# EAGLE schematic led_cube (EAGLE 9.6.2)
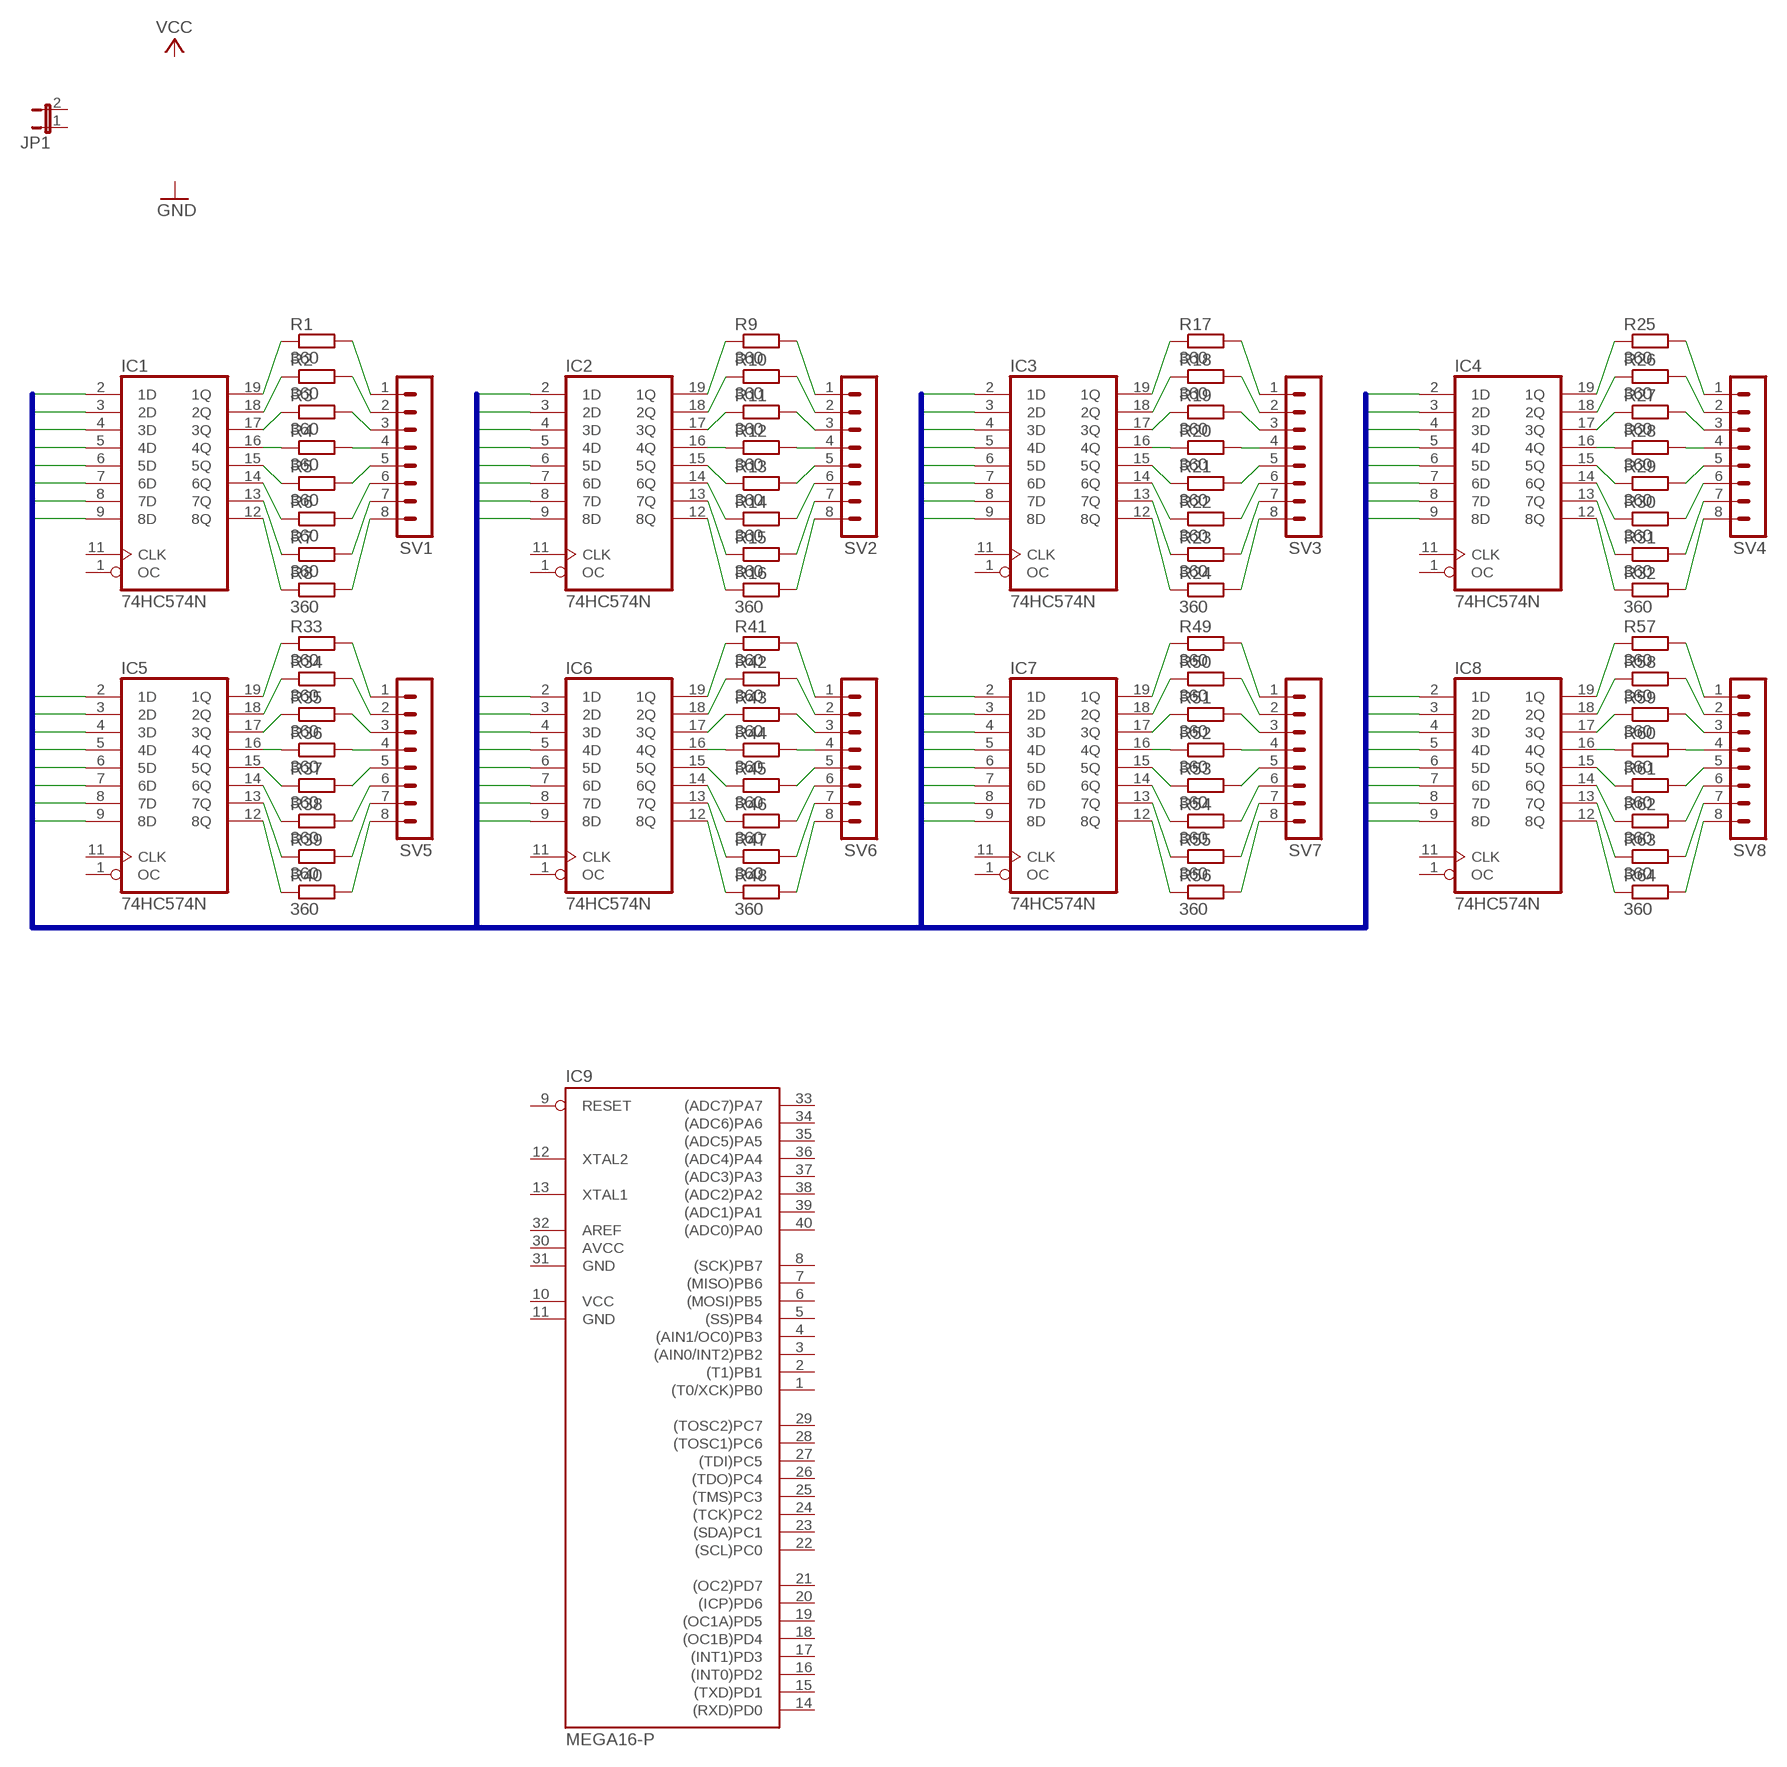
[diagram p0: schematic, sheet 1]

## Parts
IC1  74HC574N  [DIL20]
IC2  74HC574N  [DIL20]
IC3  74HC574N  [DIL20]
IC4  74HC574N  [DIL20]
IC5  74HC574N  [DIL20]
IC6  74HC574N  [DIL20]
IC7  74HC574N  [DIL20]
IC8  74HC574N  [DIL20]
IC9  MEGA16-P  [DIL40]
JP1  JP1E  [JP1]
R1  360  R-EU_0204/5  [0204/5]
R2  360  R-EU_0204/5  [0204/5]
R3  360  R-EU_0204/5  [0204/5]
R4  360  R-EU_0204/5  [0204/5]
R5  360  R-EU_0204/5  [0204/5]
R6  360  R-EU_0204/5  [0204/5]
R7  360  R-EU_0204/5  [0204/5]
R8  360  R-EU_0204/5  [0204/5]
R9  360  R-EU_0204/5  [0204/5]
R10  360  R-EU_0204/5  [0204/5]
R11  360  R-EU_0204/5  [0204/5]
R12  360  R-EU_0204/5  [0204/5]
R13  360  R-EU_0204/5  [0204/5]
R14  360  R-EU_0204/5  [0204/5]
R15  360  R-EU_0204/5  [0204/5]
R16  360  R-EU_0204/5  [0204/5]
R17  360  R-EU_0204/5  [0204/5]
R18  360  R-EU_0204/5  [0204/5]
R19  360  R-EU_0204/5  [0204/5]
R20  360  R-EU_0204/5  [0204/5]
R21  360  R-EU_0204/5  [0204/5]
R22  360  R-EU_0204/5  [0204/5]
R23  360  R-EU_0204/5  [0204/5]
R24  360  R-EU_0204/5  [0204/5]
R25  360  R-EU_0204/5  [0204/5]
R26  360  R-EU_0204/5  [0204/5]
R27  360  R-EU_0204/5  [0204/5]
R28  360  R-EU_0204/5  [0204/5]
R29  360  R-EU_0204/5  [0204/5]
R30  360  R-EU_0204/5  [0204/5]
R31  360  R-EU_0204/5  [0204/5]
R32  360  R-EU_0204/5  [0204/5]
R33  360  R-EU_0204/5  [0204/5]
R34  360  R-EU_0204/5  [0204/5]
R35  360  R-EU_0204/5  [0204/5]
R36  360  R-EU_0204/5  [0204/5]
R37  360  R-EU_0204/5  [0204/5]
R38  360  R-EU_0204/5  [0204/5]
R39  360  R-EU_0204/5  [0204/5]
R40  360  R-EU_0204/5  [0204/5]
R41  360  R-EU_0204/5  [0204/5]
R42  360  R-EU_0204/5  [0204/5]
R43  360  R-EU_0204/5  [0204/5]
R44  360  R-EU_0204/5  [0204/5]
R45  360  R-EU_0204/5  [0204/5]
R46  360  R-EU_0204/5  [0204/5]
R47  360  R-EU_0204/5  [0204/5]
R48  360  R-EU_0204/5  [0204/5]
R49  360  R-EU_0204/5  [0204/5]
R50  360  R-EU_0204/5  [0204/5]
R51  360  R-EU_0204/5  [0204/5]
R52  360  R-EU_0204/5  [0204/5]
R53  360  R-EU_0204/5  [0204/5]
R54  360  R-EU_0204/5  [0204/5]
R55  360  R-EU_0204/5  [0204/5]
R56  360  R-EU_0204/5  [0204/5]
R57  360  R-EU_0204/5  [0204/5]
R58  360  R-EU_0204/5  [0204/5]
R59  360  R-EU_0204/5  [0204/5]
R60  360  R-EU_0204/5  [0204/5]
R61  360  R-EU_0204/5  [0204/5]
R62  360  R-EU_0204/5  [0204/5]
R63  360  R-EU_0204/5  [0204/5]
R64  360  R-EU_0204/5  [0204/5]
SV1  MA08-1  [MA08-1]
SV2  MA08-1  [MA08-1]
SV3  MA08-1  [MA08-1]
SV4  MA08-1  [MA08-1]
SV5  MA08-1  [MA08-1]
SV6  MA08-1  [MA08-1]
SV7  MA08-1  [MA08-1]
SV8  MA08-1  [MA08-1]

## Nets
D0: IC1.2(1D) IC1.19(1Q) IC2.2(1D) IC3.2(1D) IC4.2(1D) IC5.2(1D) IC6.2(1D) IC7.2(1D) IC8.2(1D) R1.1
D1: IC1.3(2D) IC1.18(2Q) IC2.3(2D) IC3.3(2D) IC4.3(2D) IC5.3(2D) IC6.3(2D) IC7.3(2D) IC8.3(2D) R2.1
D2: IC1.4(3D) IC1.17(3Q) IC2.4(3D) IC3.4(3D) IC4.4(3D) IC5.4(3D) IC6.4(3D) IC7.4(3D) IC8.4(3D) R3.1
D3: IC1.5(4D) IC1.16(4Q) IC2.5(4D) IC3.5(4D) IC4.5(4D) IC5.5(4D) IC6.5(4D) IC7.5(4D) IC8.5(4D) R4.1
D4: IC1.6(5D) IC1.15(5Q) IC2.6(5D) IC3.6(5D) IC4.6(5D) IC5.6(5D) IC6.6(5D) IC7.6(5D) IC8.6(5D) R5.1
D5: IC1.7(6D) IC1.14(6Q) IC2.7(6D) IC3.7(6D) IC4.7(6D) IC5.7(6D) IC6.7(6D) IC7.7(6D) IC8.7(6D) R6.1
D6: IC1.8(7D) IC1.13(7Q) IC2.8(7D) IC3.8(7D) IC4.8(7D) IC5.8(7D) IC6.8(7D) IC7.8(7D) IC8.8(7D) R7.1
D7: IC1.9(8D) IC1.12(8Q) IC2.9(8D) IC3.9(8D) IC4.9(8D) IC5.9(8D) IC6.9(8D) IC7.9(8D) IC8.9(8D) R8.1
N$9: R1.2 SV1.1
N$10: R2.2 SV1.2
N$11: R3.2 SV1.3
N$12: R4.2 SV1.4
N$13: R5.2 SV1.5
N$14: R6.2 SV1.6
N$15: R7.2 SV1.7
N$16: R8.2 SV1.8
N$17: IC2.19(1Q) R9.1
N$18: IC2.18(2Q) R10.1
N$19: IC2.17(3Q) R11.1
N$20: IC2.16(4Q) R12.1
N$21: IC2.15(5Q) R13.1
N$22: IC2.14(6Q) R14.1
N$23: IC2.13(7Q) R15.1
N$24: IC2.12(8Q) R16.1
N$25: R9.2 SV2.1
N$26: R10.2 SV2.2
N$27: R11.2 SV2.3
N$28: R12.2 SV2.4
N$29: R13.2 SV2.5
N$30: R14.2 SV2.6
N$31: R15.2 SV2.7
N$32: R16.2 SV2.8
N$33: IC3.19(1Q) R17.1
N$34: IC3.18(2Q) R18.1
N$35: IC3.17(3Q) R19.1
N$36: IC3.16(4Q) R20.1
N$37: IC3.15(5Q) R21.1
N$38: IC3.14(6Q) R22.1
N$39: IC3.13(7Q) R23.1
N$40: IC3.12(8Q) R24.1
N$41: R17.2 SV3.1
N$42: R18.2 SV3.2
N$43: R19.2 SV3.3
N$44: R20.2 SV3.4
N$45: R21.2 SV3.5
N$46: R22.2 SV3.6
N$47: R23.2 SV3.7
N$48: R24.2 SV3.8
N$49: IC4.19(1Q) R25.1
N$50: IC4.18(2Q) R26.1
N$51: IC4.17(3Q) R27.1
N$52: IC4.16(4Q) R28.1
N$53: IC4.15(5Q) R29.1
N$54: IC4.14(6Q) R30.1
N$55: IC4.13(7Q) R31.1
N$56: IC4.12(8Q) R32.1
N$57: R25.2 SV4.1
N$58: R26.2 SV4.2
N$59: R27.2 SV4.3
N$60: R28.2 SV4.4
N$61: R29.2 SV4.5
N$62: R30.2 SV4.6
N$63: R31.2 SV4.7
N$64: R32.2 SV4.8
N$65: IC5.19(1Q) R33.1
N$66: IC5.18(2Q) R34.1
N$67: IC5.17(3Q) R35.1
N$68: IC5.16(4Q) R36.1
N$69: IC5.15(5Q) R37.1
N$70: IC5.14(6Q) R38.1
N$71: IC5.13(7Q) R39.1
N$72: IC5.12(8Q) R40.1
N$73: R33.2 SV5.1
N$74: R34.2 SV5.2
N$75: R35.2 SV5.3
N$76: R36.2 SV5.4
N$77: R37.2 SV5.5
N$78: R38.2 SV5.6
N$79: R39.2 SV5.7
N$80: R40.2 SV5.8
N$81: IC6.19(1Q) R41.1
N$82: IC6.18(2Q) R42.1
N$83: IC6.17(3Q) R43.1
N$84: IC6.16(4Q) R44.1
N$85: IC6.15(5Q) R45.1
N$86: IC6.14(6Q) R46.1
N$87: IC6.13(7Q) R47.1
N$88: IC6.12(8Q) R48.1
N$89: R41.2 SV6.1
N$90: R42.2 SV6.2
N$91: R43.2 SV6.3
N$92: R44.2 SV6.4
N$93: R45.2 SV6.5
N$94: R46.2 SV6.6
N$95: R47.2 SV6.7
N$96: R48.2 SV6.8
N$97: IC7.19(1Q) R49.1
N$98: IC7.18(2Q) R50.1
N$99: IC7.17(3Q) R51.1
N$100: IC7.16(4Q) R52.1
N$101: IC7.15(5Q) R53.1
N$102: IC7.14(6Q) R54.1
N$103: IC7.13(7Q) R55.1
N$104: IC7.12(8Q) R56.1
N$105: R49.2 SV7.1
N$106: R50.2 SV7.2
N$107: R51.2 SV7.3
N$108: R52.2 SV7.4
N$109: R53.2 SV7.5
N$110: R54.2 SV7.6
N$111: R55.2 SV7.7
N$112: R56.2 SV7.8
N$113: IC8.19(1Q) R57.1
N$114: IC8.18(2Q) R58.1
N$115: IC8.17(3Q) R59.1
N$116: IC8.16(4Q) R60.1
N$117: IC8.15(5Q) R61.1
N$118: IC8.14(6Q) R62.1
N$119: IC8.13(7Q) R63.1
N$120: IC8.12(8Q) R64.1
N$121: R57.2 SV8.1
N$122: R58.2 SV8.2
N$123: R59.2 SV8.3
N$124: R60.2 SV8.4
N$125: R61.2 SV8.5
N$126: R62.2 SV8.6
N$127: R63.2 SV8.7
N$128: R64.2 SV8.8
Unconnected: IC1.1(OC) IC1.11(CLK) IC2.1(OC) IC2.11(CLK) IC3.1(OC) IC3.11(CLK) IC4.1(OC) IC4.11(CLK) IC5.1(OC) IC5.11(CLK) IC6.1(OC) IC6.11(CLK) IC7.1(OC) IC7.11(CLK) IC8.1(OC) IC8.11(CLK) IC9.1((T0/XCK)PB0) IC9.2((T1)PB1) IC9.3((AIN0/INT2)PB2) IC9.4((AIN1/OC0)PB3) IC9.5((SS)PB4) IC9.6((MOSI)PB5) IC9.7((MISO)PB6) IC9.8((SCK)PB7) IC9.9(RESET) IC9.12(XTAL2) IC9.13(XTAL1) IC9.14((RXD)PD0) IC9.15((TXD)PD1) IC9.16((INT0)PD2) IC9.17((INT1)PD3) IC9.18((OC1B)PD4) IC9.19((OC1A)PD5) IC9.20((ICP)PD6) IC9.21((OC2)PD7) IC9.22((SCL)PC0) IC9.23((SDA)PC1) IC9.24((TCK)PC2) IC9.25((TMS)PC3) IC9.26((TDO)PC4) IC9.27((TDI)PC5) IC9.28((TOSC1)PC6) IC9.29((TOSC2)PC7) IC9.32(AREF) IC9.33((ADC7)PA7) IC9.34((ADC6)PA6) IC9.35((ADC5)PA5) IC9.36((ADC4)PA4) IC9.37((ADC3)PA3) IC9.38((ADC2)PA2) IC9.39((ADC1)PA1) IC9.40((ADC0)PA0) JP1.1 JP1.2

## Buses
DATA8:D0,D1,D2,D3,D4,D5,D6,D7

## Power pins joined to a net without a drawn wire
AVCC: IC9.30(AVCC)
GND: IC1.10(GND) IC2.10(GND) IC3.10(GND) IC4.10(GND) IC5.10(GND) IC6.10(GND) IC7.10(GND) IC8.10(GND) IC9.11(GND) IC9.31(GND)
VCC: IC1.20(VCC) IC2.20(VCC) IC3.20(VCC) IC4.20(VCC) IC5.20(VCC) IC6.20(VCC) IC7.20(VCC) IC8.20(VCC) IC9.10(VCC)

## Library data of the parts
IC1-IC8 = 74xx-eu:74*574: 8-bit D type FLIP FLOP bus driver; SPICEPREFIX: X
IC9 = atmel:MEGA16-P: MICROCONTROLLER 16 Kbytes FLASH 1 kbytes SRAM 512 bytes EEPROM USART 8-channel 10 bit ADC Source: avr.lbr; MPN: ATMEGA16-16PU; OC_FARNELL: 9171142; OC_NEWARK: 01M6885
JP1 = jumper:JP1E: JUMPER
R1-R64 = rcl:R-EU_: RESISTOR, European symbol; SPICEPREFIX: R
SV1-SV8 = con-lstb:MA08-1: PIN HEADER; OC_FARNELL: unknown; OC_NEWARK: unknown